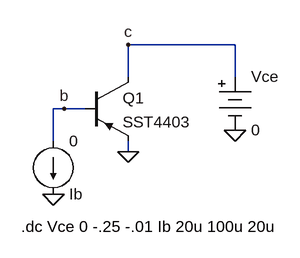
[diagram p0: schematic 24-5-7-a-1-1.asc]
24-5-7-a-1-1.asc, the LTspice schematic file:
Version 4
SHEET 1 880 680
WIRE 384 48 224 48
WIRE 224 96 224 48
WIRE 384 96 384 48
WIRE 128 144 112 144
WIRE 160 144 128 144
WIRE 112 192 112 144
WIRE 224 208 224 192
FLAG 384 176 0
FLAG 224 208 0
FLAG 112 272 0
FLAG 224 48 c
FLAG 128 144 b
SYMBOL current 112 192 R0
WINDOW 0 24 80 Left 2
WINDOW 3 24 0 Left 2
WINDOW 123 0 0 Left 0
WINDOW 39 0 0 Left 0
SYMATTR InstName Ib
SYMATTR Value 0
SYMBOL Misc\\battery 384 80 R0
WINDOW 123 0 0 Left 0
WINDOW 39 0 0 Left 0
SYMATTR InstName Vce
SYMATTR Value 0
SYMBOL pnp 160 96 R0
SYMATTR InstName Q1
SYMATTR Value SST4403
TEXT 64 320 Left 2 !.dc Vce 0 -.25 -.01 Ib 20u 100u 20u

The netlist it stands for:
* 24-5-7-a-1-1.asc
Ib b 0 0
Vce c 0 0
Q1 c b 0 0 SST4403
.model NPN NPN
.model PNP PNP
.lib standard.bjt
.dc Vce 0 -.25 -.01 Ib 20u 100u 20u
.backanno
.end